# Altium schematic sheet TopSheet.SchDoc: Resolver
size A4; CompanyName: Technische Hochschule Nürnberg Georg Simon Ohm; DrawnBy: Bauer Martin; Engineer: Bauer Martin; Organization: UltraZohm; Address1: Kesslerplatz 12; Address2: 90489 Nürnberg; Address3: GERMANY; DocumentNumber: 1; Revision: A; SheetNumber: 1; SheetTotal: 6; Website: www.ultrazohm.com
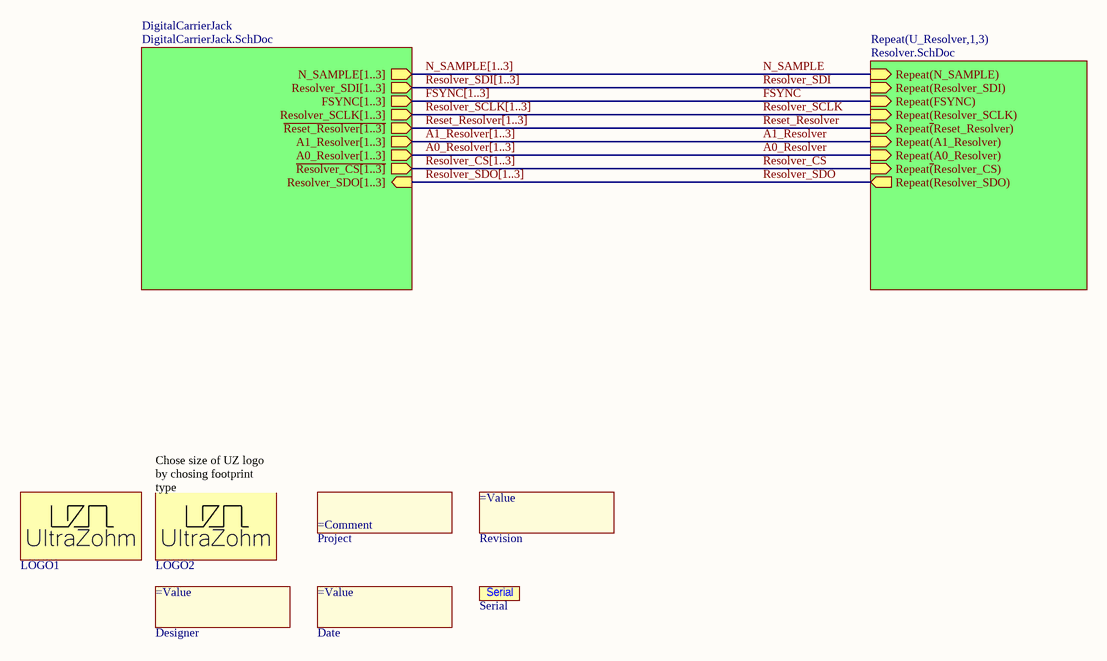
[diagram p0: TopSheet.SchDoc]

## Parts
Date  (no value)  [COMMENT]  (no BOM)
Designer  (no value)  [Designator:comment]  (no BOM)
LOGO1  UZ Logo  [UZ_Logo_large]  (value not drawn)  (no BOM)
LOGO2  UZ Logo  [UZ_Logo_tiny]  (value not drawn)  (no BOM)
Project  (no value)  [COMMENT]  (no BOM)
Revision  (no value)  [Designator:comment]  (no BOM)
Serial  Serial #  [SERIAL]  (value not drawn)

## Sub-sheets
DigitalCarrierJack = DigitalCarrierJack.SchDoc: ~{Resolver_CS[1..3]} (out), A1_Resolver[1..3] (out), ~{Reset_Resolver[1..3]} (out), FSYNC[1..3] (out), N_SAMPLE[1..3] (out), A0_Resolver[1..3] (out), Resolver_SCLK[1..3] (out), Resolver_SDO[1..3] (in), Resolver_SDI[1..3] (out)
Repeat(U_Resolver,1,3) = Resolver.SchDoc: Repeat(N_SAMPLE) (in), Repeat(Resolver_SDO) (out), Repeat(Resolver_SDI) (in), Repeat(FSYNC) (in), Repeat(Resolver_SCLK) (in), Repeat~{(}Reset_Resolver) (in), Repeat(A1_Resolver) (in), Repeat(A0_Resolver) (in), Repeat~{(}Resolver_CS) (in)

## Nets
~{Reset_Resolver}: sheet Repeat(U_Resolver,1,3)/Repeat~{(}Reset_Resolver)
~{Resolver_CS}: sheet Repeat(U_Resolver,1,3)/Repeat~{(}Resolver_CS)
A0_Resolver: sheet Repeat(U_Resolver,1,3)/Repeat(A0_Resolver)
A1_Resolver: sheet Repeat(U_Resolver,1,3)/Repeat(A1_Resolver)
FSYNC: sheet Repeat(U_Resolver,1,3)/Repeat(FSYNC)
N_SAMPLE: sheet Repeat(U_Resolver,1,3)/Repeat(N_SAMPLE)
Resolver_SCLK: sheet Repeat(U_Resolver,1,3)/Repeat(Resolver_SCLK)
Resolver_SDI: sheet Repeat(U_Resolver,1,3)/Repeat(Resolver_SDI)
Resolver_SDO: sheet Repeat(U_Resolver,1,3)/Repeat(Resolver_SDO)

## Buses and harness runs
bus A0_Resolver[1..3] = sheet DigitalCarrierJack/A0_Resolver[1..3]
bus A1_Resolver[1..3] = sheet DigitalCarrierJack/A1_Resolver[1..3]
bus FSYNC[1..3] = sheet DigitalCarrierJack/FSYNC[1..3]
bus N_SAMPLE[1..3] = sheet DigitalCarrierJack/N_SAMPLE[1..3]
bus Resolver_SCLK[1..3] = sheet DigitalCarrierJack/Resolver_SCLK[1..3]
bus Resolver_SDI[1..3] = sheet DigitalCarrierJack/Resolver_SDI[1..3]
bus Resolver_SDO[1..3] = sheet DigitalCarrierJack/Resolver_SDO[1..3]
bus ~{Reset_Resolver[1..3]} = sheet DigitalCarrierJack/~{Reset_Resolver[1..3]}
bus ~{Resolver_CS[1..3]} = sheet DigitalCarrierJack/~{Resolver_CS[1..3]}

## Notes on the sheet
- (near LOGO2) Chose size of UZ logo by chosing footprint type
- Title
- Revision:
- Design Engineer:
- Date:
- Project:
- Sheet
- of

## Library data of the parts
Date = 5: Create a project parameter named "FinDate" this is the value of this component. It is printed on the PCB. Once the parameter is updated (e.g. new revision) it gets updated on the PCB as well; Manufacturer: PCB Manufacturer; Manufacturer Part Number: Project End Date; Created from: T. Wendt; PartID: 5; Created On: 01.03.2021 09:01:41; Component Type: Date of Project Finalization; Last Updated: 01.03.2021 09:01:41; Type: Standard (No BOM); Value: =FinDate; Live Cycle Status: 1
Designer = 4: Create a project parameter named "Author" this is the value of this component. It is printed on the PCB. Once the parameter is updated (e.g. new revision) it gets updated on the PCB as well; Manufacturer: PCB Manufacturer; Manufacturer Part Number: Project Author; Created from: T. Wendt; PartID: 4; Created On: 01.03.2021 08:53:41; Component Type: Project Author; Last Updated: 01.03.2021 09:20:27; Type: Standard (No BOM); Value: =AuthorParam; Live Cycle Status: 1
LOGO1 LOGO2 = 1: Official Project Logo of the UltraZohm; Manufacturer: PCB Manufacturer; Manufacturer Part Number: UltraZohm Logo; Created from: T. Wendt; PartID: 1; Created On: 19.02.2021 16:55:56; ComponentLink1Description: Homepage; ComponentLink1URL: https://ultrazohm.com; Component Type: Logo; Last Updated: 02.03.2021 14:31:24; Type: Standard (No BOM); Live Cycle Status: 1
Project = 2: Create a project parameter named "ProjectNameCustom" this is the value of this component and it is printed on the PCB.; Manufacturer: PCB Manufacturer; Created from: T. Wendt; PartID: 2; Created On: 01.03.2021 08:43:57; Component Type: Project Name; Last Updated: 01.03.2021 09:07:27; Manufacturer Part Number: Project Name; Type: Standard (No BOM); Value: =ProjectNameCustom; Live Cycle Status: 1
Revision = 3: Create a project parameter named "ProjectRevision" this is the value of this component. It is printed on the PCB. Once the parameter is updated (e.g. new revision) it gets updated on the PCB as well; Manufacturer: PCB Manufacturer; Created from: T. Wendt; PartID: 3; Created On: 01.03.2021 08:50:34; Component Type: Project Revision; Last Updated: 01.03.2021 09:28:36; Manufacturer Part Number: Project Revision; Type: Standard (No BOM); Value: =ProjectRevision; Live Cycle Status: 1
Serial = 6: Field to put in a serial number; Manufacturer: PCB Manufacturer; Created from: T. Wendt; PartID: 6; Created On: 02.03.2021 14:31:24; Component Type: Serial Number; Last Updated: 02.03.2021 14:31:24; Manufacturer Part Number: Serial Number; Type: Standard (No BOM); Live Cycle Status: 1